# Altium schematic sheet TP_IHM_7SEG.SchDoc
size A4
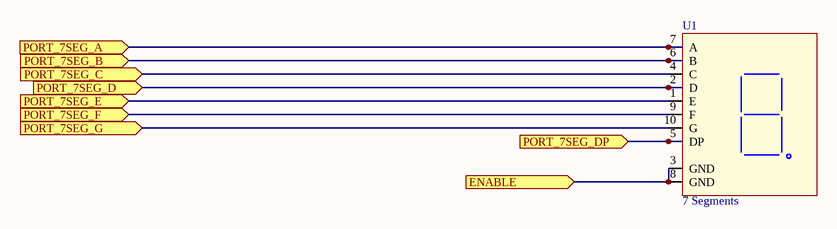
[diagram p0: TP_IHM_7SEG.SchDoc]

## Parts
U1  7 Segments  [SA10-21GWA]

## Ports
ENABLE (in), PORT_7SEG_A (in), PORT_7SEG_B (in), PORT_7SEG_C (in), PORT_7SEG_D (in), PORT_7SEG_DP (in), PORT_7SEG_E (in), PORT_7SEG_F (in), PORT_7SEG_G (in)

## Nets
ENABLE: U1.3(GND) U1.8(GND) ; port ENABLE
PORT_7SEG_A: U1.7(A) ; port PORT_7SEG_A
PORT_7SEG_B: U1.6(B) ; port PORT_7SEG_B
PORT_7SEG_C: U1.4(C) ; port PORT_7SEG_C
PORT_7SEG_D: U1.2(D) ; port PORT_7SEG_D
PORT_7SEG_DP: U1.5(DP) ; port PORT_7SEG_DP
PORT_7SEG_E: U1.1(E) ; port PORT_7SEG_E
PORT_7SEG_F: U1.9(F) ; port PORT_7SEG_F
PORT_7SEG_G: U1.10(G) ; port PORT_7SEG_G

## Library data of the parts
U1 = SC10-21SRWA: KingBright Led 7 Segments; Reference: SC10-21SRWA